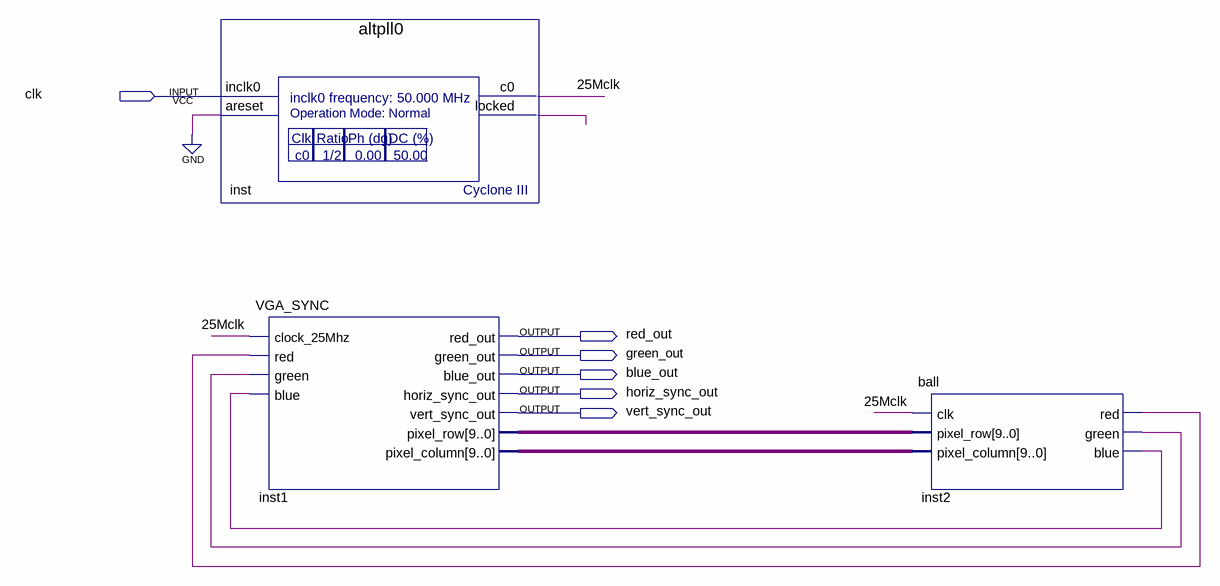
[diagram p0: schematic sheet]
// Quartus schematic Ball_Example.bdf as structural Verilog: 3 symbols, 6 pins
module Ball_Example (
  input  clk,
  output red_out,
  output green_out,
  output blue_out,
  output horiz_sync_out,
  output vert_sync_out
);

  wire \25Mclk , inst2_blue, inst2_green, inst2_red, inst_locked;
  wire [9:0] inst1_pixel_column, inst1_pixel_row;

  altpll0 inst (.inclk0(clk), .areset(1'b0), .c0(\25Mclk ), .locked(inst_locked));
  VGA_SYNC inst1 (
    .clock_25Mhz(\25Mclk ), .red(inst2_red), .green(inst2_green), .blue(inst2_blue), .red_out(red_out),
    .green_out(green_out), .blue_out(blue_out), .horiz_sync_out(horiz_sync_out),
    .vert_sync_out(vert_sync_out), .pixel_row(inst1_pixel_row), .pixel_column(inst1_pixel_column));
  ball inst2 (
    .clk(\25Mclk ), .pixel_row(inst1_pixel_row), .pixel_column(inst1_pixel_column), .red(inst2_red),
    .green(inst2_green), .blue(inst2_blue));
endmodule
